# Altium schematic sheet Temperature Sensor.SchDoc
size A; SheetNumber: 7; SheetTotal: 8
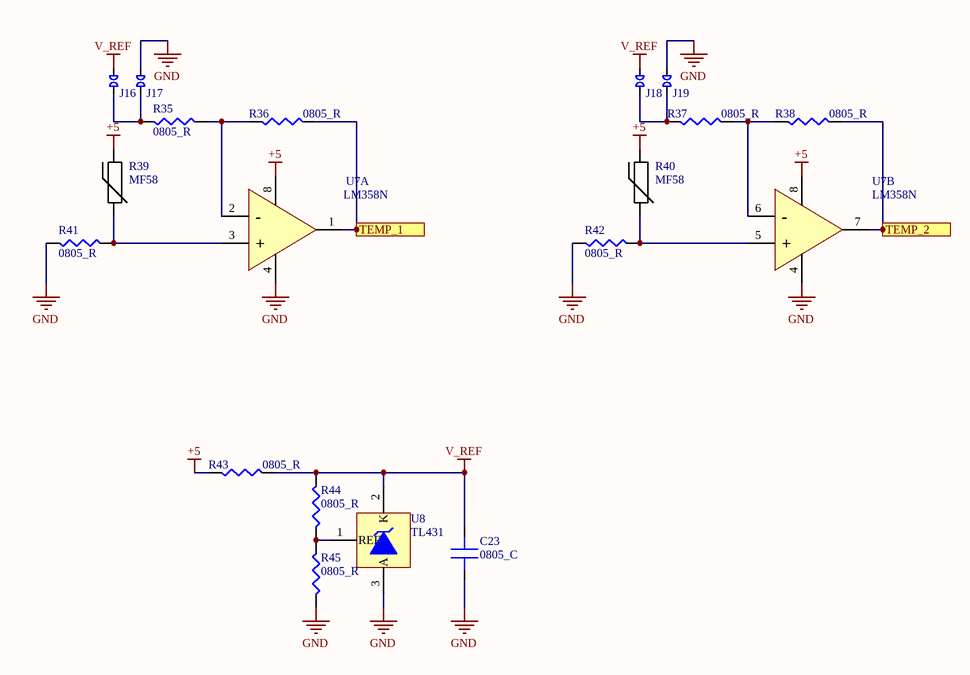
[diagram p0: Temperature Sensor.SchDoc]

## Parts
C23  0805_C  [C0805 - 0.1uf]
J16  Jumper Pads  [JMP]  (value not drawn)
J17  Jumper Pads  [JMP]  (value not drawn)
J18  Jumper Pads  [JMP]  (value not drawn)
J19  Jumper Pads  [JMP]  (value not drawn)
R35  0805_R  [R0805]
R36  0805_R  [R0805]
R37  0805_R  [R0805]
R38  0805_R  [R0805]
R39  MF58  [NTC 3mm]
R40  MF58  [NTC 3mm]
R41  0805_R  [R0805]
R42  0805_R  [R0805]
R43  0805_R  [R0805]
R44  0805_R  [R0805]
R45  0805_R  [R0805]
U7  LM358N  [SOP8]  (parts A,B of 2)
U8  TL431  [SO-23]

## Ports
TEMP_1 (out), TEMP_2 (out)

## Nets
+5: R39.2 R40.2 R43.2 U7.8(VCC)
GND: C23.1 J17.2 J19.2 R41.1 R42.1 R45.2 U7.4(VSS) U8.3(A)
V_REF: C23.2 J16.2 J18.2 R43.1 R44.1 U8.2(K)
TEMP_1: R36.1 U7.1(OUT1) ; port TEMP_1
TEMP_2: R38.1 U7.7(OUT1) ; port TEMP_2
NetJ16_1: J16.1 J17.1 R35.1
NetJ18_1: J18.1 J19.1 R37.2
NetR35_2: R35.2 R36.2 U7.2(-)
NetR37_1: R37.1 R38.2 U7.6(-)
NetR39_1: R39.1 R41.2 U7.3(+)
NetR40_1: R40.1 R42.2 U7.5(+)
NetR44_2: R44.2 R45.1 U8.1(REF)

## Library data of the parts
C23 = 0805 Capacitor
R35-R38 R41-R45 = 0805 Resistor
R39 R40 = MF58: NTC 100K THERMISTOR MF58
U8 = TL431: SMD Voltage References SOT-23